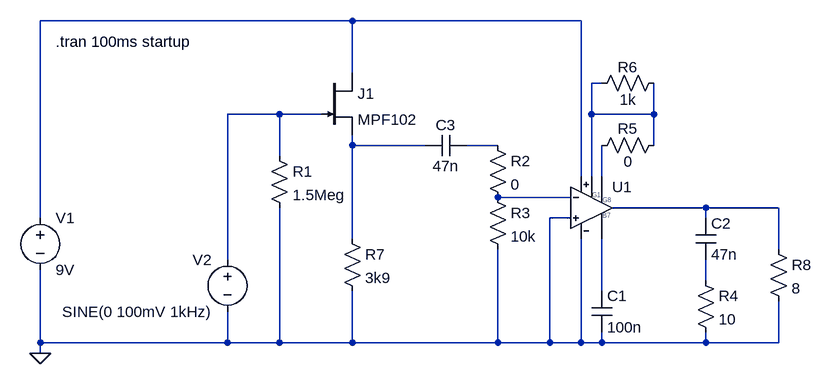
[diagram p0: schematic LM386-jig.asc]
LM386-jig.asc, the LTspice schematic file:
Version 4
SHEET 1 880 680
WIRE 64 -16 -416 -16
WIRE 416 -16 64 -16
WIRE 64 64 64 -16
WIRE 448 80 432 80
WIRE -48 128 -128 128
WIRE 16 128 -48 128
WIRE 432 128 432 80
WIRE 528 128 528 80
WIRE 528 128 432 128
WIRE 64 176 64 160
WIRE 176 176 64 176
WIRE 288 176 240 176
WIRE 528 176 528 128
WIRE -48 192 -48 128
WIRE 416 224 416 -16
WIRE 432 224 432 128
WIRE 448 224 448 176
WIRE 400 256 288 256
WIRE 608 272 464 272
WIRE 720 272 608 272
WIRE -416 288 -416 -16
WIRE 400 288 368 288
WIRE 608 288 608 272
WIRE 64 320 64 176
WIRE 720 336 720 272
WIRE -128 352 -128 128
WIRE 608 384 608 352
WIRE 448 400 448 320
WIRE -416 480 -416 368
WIRE -128 480 -128 432
WIRE -128 480 -416 480
WIRE -48 480 -48 272
WIRE -48 480 -128 480
WIRE 64 480 64 400
WIRE 64 480 -48 480
WIRE 288 480 288 336
WIRE 288 480 64 480
WIRE 368 480 368 288
WIRE 368 480 288 480
WIRE 416 480 416 320
WIRE 416 480 368 480
WIRE 448 480 448 464
WIRE 448 480 416 480
WIRE 608 480 608 464
WIRE 608 480 448 480
WIRE 720 480 720 416
WIRE 720 480 608 480
WIRE -416 496 -416 480
FLAG -416 496 0
SYMBOL voltage -416 272 R0
WINDOW 123 0 0 Left 0
WINDOW 39 0 0 Left 0
SYMATTR InstName V1
SYMATTR Value 9V
SYMBOL voltage -128 336 M0
WINDOW 123 0 0 Left 0
WINDOW 39 0 0 Left 0
SYMATTR InstName V2
SYMATTR Value SINE(0 100mV 1kHz)
SYMBOL res -64 176 R0
SYMATTR InstName R1
SYMATTR Value 1.5Meg
SYMBOL res 272 160 R0
SYMATTR InstName R2
SYMATTR Value 0
SYMBOL res 272 240 R0
SYMATTR InstName R3
SYMATTR Value 10k
SYMBOL njf 16 64 R0
SYMATTR InstName J1
SYMATTR Value MPF102
SYMBOL cap 432 400 R0
SYMATTR InstName C1
SYMATTR Value 100n
SYMBOL cap 592 288 R0
SYMATTR InstName C2
SYMATTR Value 47n
SYMBOL res 592 368 R0
SYMATTR InstName R4
SYMATTR Value 10
SYMBOL res 544 160 R90
WINDOW 0 6 56 VBottom 2
WINDOW 3 25 56 VTop 2
SYMATTR InstName R5
SYMATTR Value 0
SYMBOL res 432 96 R270
WINDOW 0 25 56 VTop 2
WINDOW 3 6 56 VBottom 2
SYMATTR InstName R6
SYMATTR Value 1k
SYMBOL res 48 304 R0
SYMATTR InstName R7
SYMATTR Value 3k9
SYMBOL cap 240 160 R90
WINDOW 0 0 32 VBottom 2
WINDOW 3 32 32 VTop 2
SYMATTR InstName C3
SYMATTR Value 47n
SYMBOL _PERSONAL\\opamps\\LM386 416 272 R0
SYMATTR InstName U1
SYMBOL res 704 320 R0
SYMATTR InstName R8
SYMATTR Value 8
TEXT -392 16 Left 2 !.tran 100ms startup

The netlist it stands for:
* LM386-jig.asc
V1 N001 0 9V
V2 N003 0 SINE(0 100mV 1kHz)
R1 N003 0 1.5Meg
R2 N005 N007 0
R3 N007 0 10k
J1 N001 N003 N004 MPF102
C1 N010 0 100n
C2 N008 N009 47n
R4 N009 0 10
R5 N002 N006 0
R6 N002 N002 1k
R7 N004 0 3k9
C3 N005 N004 47n
XU1 N002 N007 0 0 N008 N001 N010 N006 LM386  ; pins g1 inn inp gnd out vs byp g8
R8 N008 0 8
.model NJF NJF
.model PJF PJF
.lib standard.jft
.tran 100ms startup
.lib ../sym/_PERSONAL/opamps/LM386.sub
.backanno
.end